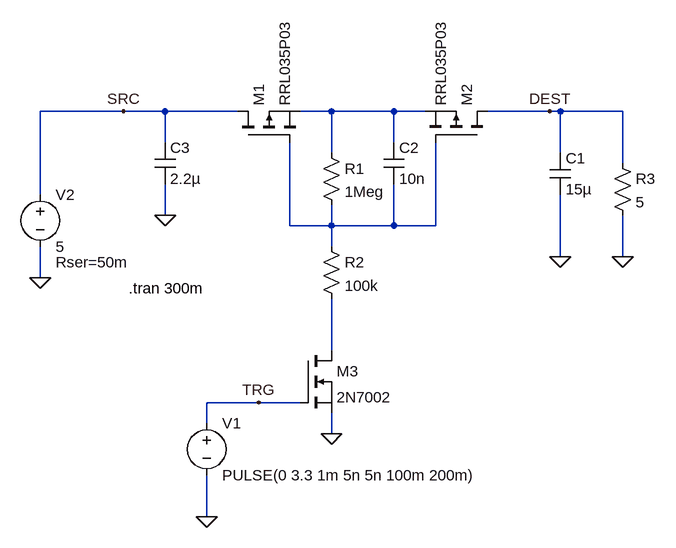
[diagram p0: schematic bus_switch.asc]
bus_switch.asc, the LTspice schematic file:
Version 4.1
SHEET 1 880 772
WIRE 48 128 -80 128
WIRE 112 128 48 128
WIRE 224 128 112 128
WIRE 368 128 320 128
WIRE 464 128 368 128
WIRE 512 128 464 128
WIRE 704 128 608 128
WIRE 720 128 704 128
WIRE 816 128 720 128
WIRE 112 176 112 128
WIRE 464 176 464 128
WIRE 368 192 368 128
WIRE 720 192 720 128
WIRE 816 208 816 128
WIRE -80 256 -80 128
WIRE 112 288 112 240
WIRE 304 304 304 176
WIRE 368 304 368 272
WIRE 368 304 304 304
WIRE 464 304 464 240
WIRE 464 304 368 304
WIRE 528 304 528 176
WIRE 528 304 464 304
WIRE 368 336 368 304
WIRE 720 352 720 256
WIRE 816 352 816 288
WIRE -80 384 -80 336
WIRE 368 496 368 416
WIRE 256 576 176 576
WIRE 320 576 256 576
WIRE 176 608 176 576
WIRE 368 624 368 592
WIRE 176 752 176 688
FLAG 368 624 0
FLAG 176 752 0
FLAG 256 576 TRG
FLAG -80 384 0
FLAG 816 352 0
FLAG 48 128 SRC
FLAG 704 128 DEST
FLAG 720 352 0
FLAG 112 288 0
SYMBOL pmos 608 176 M270
SYMATTR InstName M2
SYMATTR Value RRL035P03
SYMBOL res 352 176 R0
SYMATTR InstName R1
SYMATTR Value 1Meg
SYMBOL res 352 320 R0
SYMATTR InstName R2
SYMATTR Value 100k
SYMBOL nmos 320 496 R0
SYMATTR InstName M3
SYMATTR Value 2N7002
SYMBOL voltage 176 592 R0
WINDOW 123 0 0 Left 0
WINDOW 39 0 0 Left 0
SYMATTR InstName V1
SYMATTR Value PULSE(0 3.3 1m 5n 5n 100m 200m)
SYMBOL voltage -80 240 R0
WINDOW 123 0 0 Left 0
WINDOW 39 24 120 Left 2
SYMATTR SpiceLine Rser=50m
SYMATTR InstName V2
SYMATTR Value 5
SYMBOL res 800 192 R0
SYMATTR InstName R3
SYMATTR Value 5
SYMBOL pmos 224 176 R270
SYMATTR InstName M1
SYMATTR Value RRL035P03
SYMBOL cap 704 192 R0
SYMATTR InstName C1
SYMATTR Value 15µ
SYMATTR SpiceLine Rser=1m
SYMBOL cap 448 176 R0
SYMATTR InstName C2
SYMATTR Value 10n
SYMATTR SpiceLine Rser=1m
SYMBOL cap 96 176 R0
SYMATTR InstName C3
SYMATTR Value 2.2µ
SYMATTR SpiceLine Rser=1m
TEXT 56 400 Left 2 !.tran 300m

The netlist it stands for:
* bus_switch.asc
M2 DEST N002 N001 N001 RRL035P03
R1 N001 N002 1Meg
R2 N002 N003 100k
M3 N003 TRG 0 0 2N7002
V1 TRG 0 PULSE(0 3.3 1m 5n 5n 100m 200m)
V2 SRC 0 5 Rser=50m
R3 DEST 0 5
M1 SRC N002 N001 N001 RRL035P03
C1 DEST 0 15µ Rser=1m
C2 N001 N002 10n Rser=1m
C3 SRC 0 2.2µ Rser=1m
.model NMOS NMOS
.model PMOS PMOS
.lib standard.mos
.tran 300m
.backanno
.end